# EAGLE schematic DFTT (EAGLE 7.4.0)

## Sheet 1 of 2
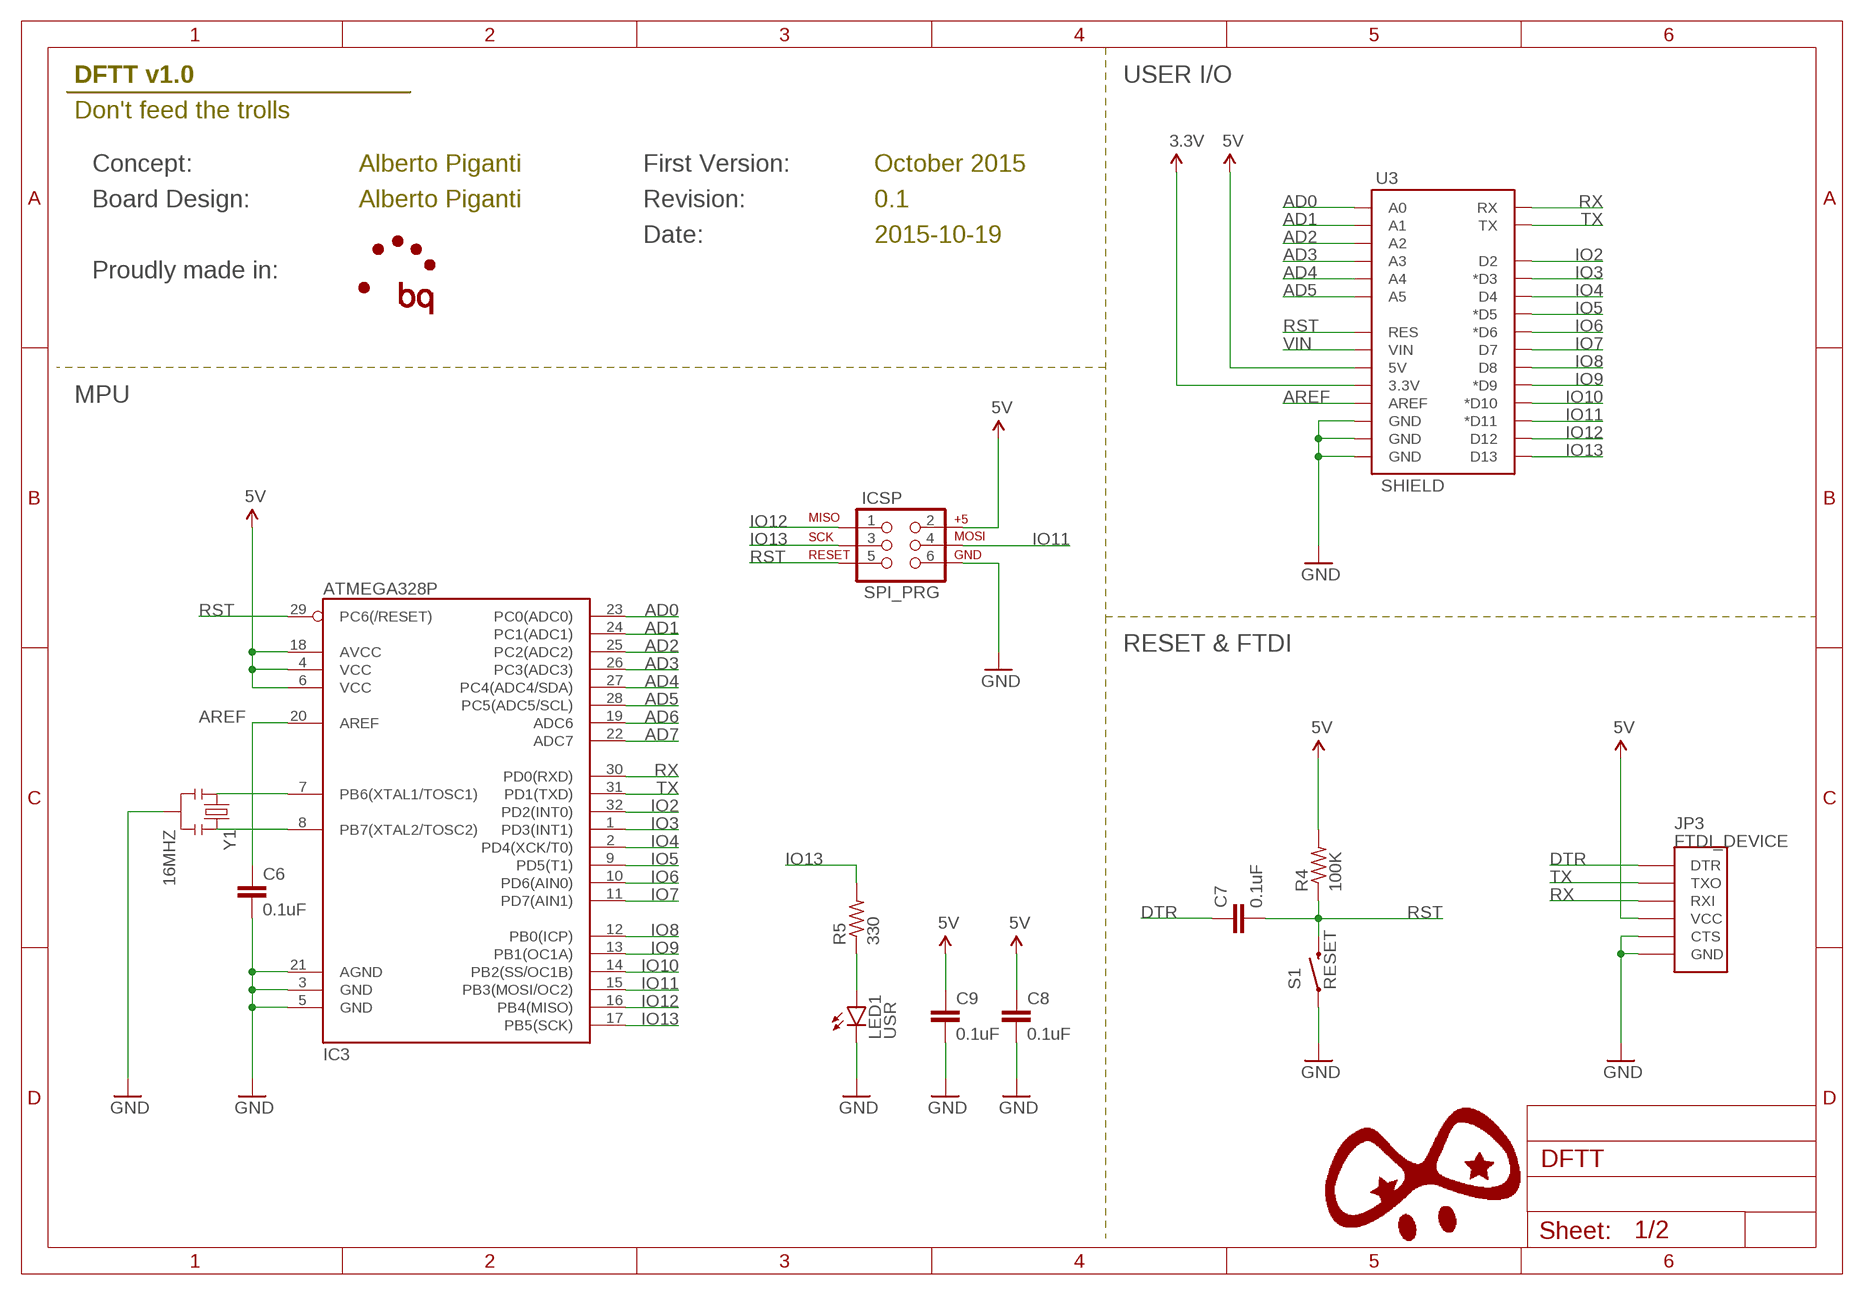
[diagram p0: schematic, sheet 1]

### Parts
C6  0.1uF  C-EUC0603  [C0603]
C7  0.1uF  C-EUC0603  [C0603]
C8  0.1uF  C-EUC0603  [C0603]
C9  0.1uF  C-EUC0603  [C0603]
IC3  ATMEGA328P  ATMEGA328_SMT  [TQFP32-08]
ICSP  SPI_PRG  AVR_SPI_PRG_6NS  [2X3-NS]
JP3  FTDI_DEVICE  [FTDI_DEVICE_SIDE]
LED1  USR  LED0603  [LED-0603]
R4  100K  R-US_R0603  [R0603]
R5  330  R-US_R0603  [R0603]
S1  RESET  SWITCH-MOMENTARY-2SMD-1101NE  [TACTILE-SWITCH-1101NE]
U3  SHIELD  ARDUINO_SHIELDNO_SILK  [DUEMILANOVE_VIAS]
Y1  16MHZ  RESONATOR16MHZ  [RESONATOR-SMD]

### Nets
3.3V: U3.3.3V ; also sheet 2
5V: C8.1 C9.1 IC3.4(VCC) IC3.6(VCC) IC3.18(AVCC) ICSP.2 JP3.P$4(VCC) R4.2 U3.5V ; also sheet 2
AD0: IC3.23(PC0(ADC0)) U3.A0
AD1: IC3.24(PC1(ADC1)) U3.A1
AD2: IC3.25(PC2(ADC2)) U3.A2
AD3: IC3.26(PC3(ADC3)) U3.A3
AD4: IC3.27(PC4(ADC4/SDA)) U3.A4
AD5: IC3.28(PC5(ADC5/SCL)) U3.A5
AD6: IC3.19(ADC6)
AD7: IC3.22(ADC7)
AREF: C6.1 IC3.20(AREF) U3.AREF
DTR: C7.1 JP3.P$1(DTR)
GND: C6.2 C8.2 C9.2 IC3.3(GND) IC3.5(GND) IC3.21(AGND) ICSP.6 JP3.P$5(CTS) JP3.P$6(GND) LED1.C S1.1 U3.GND@0(GND) U3.GND@1(GND) U3.GND@2(GND) Y1.2 ; also sheet 2
IO2: IC3.32(PD2(INT0)) U3.D2
IO3: IC3.1(PD3(INT1)) U3.D3(*D3) ; also sheet 2
IO4: IC3.2(PD4(XCK/T0)) U3.D4
IO5: IC3.9(PD5(T1)) U3.D5(*D5) ; also sheet 2
IO6: IC3.10(PD6(AIN0)) U3.D6(*D6)
IO7: IC3.11(PD7(AIN1)) U3.D7
IO8: IC3.12(PB0(ICP)) U3.D8
IO9: IC3.13(PB1(OC1A)) U3.D9(*D9) ; also sheet 2
IO10: IC3.14(PB2(SS/OC1B)) U3.D10(*D10) ; also sheet 2
IO11: IC3.15(PB3(MOSI/OC2)) ICSP.4 U3.D11(*D11) ; also sheet 2
IO12: IC3.16(PB4(MISO)) ICSP.1 U3.D12
IO13: IC3.17(PB5(SCK)) ICSP.3 R5.2 U3.D13
N$9: LED1.A R5.1
N$31: IC3.7(PB6(XTAL1/TOSC1)) Y1.1
N$32: IC3.8(PB7(XTAL2/TOSC2)) Y1.3
RST: C7.2 IC3.29(PC6(/RESET)) ICSP.5 R4.1 S1.2 U3.RES
RX: IC3.30(PD0(RXD)) JP3.P$3(RXI) U3.RX
TX: IC3.31(PD1(TXD)) JP3.P$2(TXO) U3.TX
VIN: U3.VIN

### Notes on the sheet
- DFTT v1.0 | USER I/O
- Don't feed the trolls
- Concept: | Alberto Piganti | First Version: | October 2015
- Board Design: | Alberto Piganti | Revision: | 0.1
- Date: | 2015-10-19
- Proudly made in:
- MPU
- RESET & FTDI

## Sheet 2 of 2
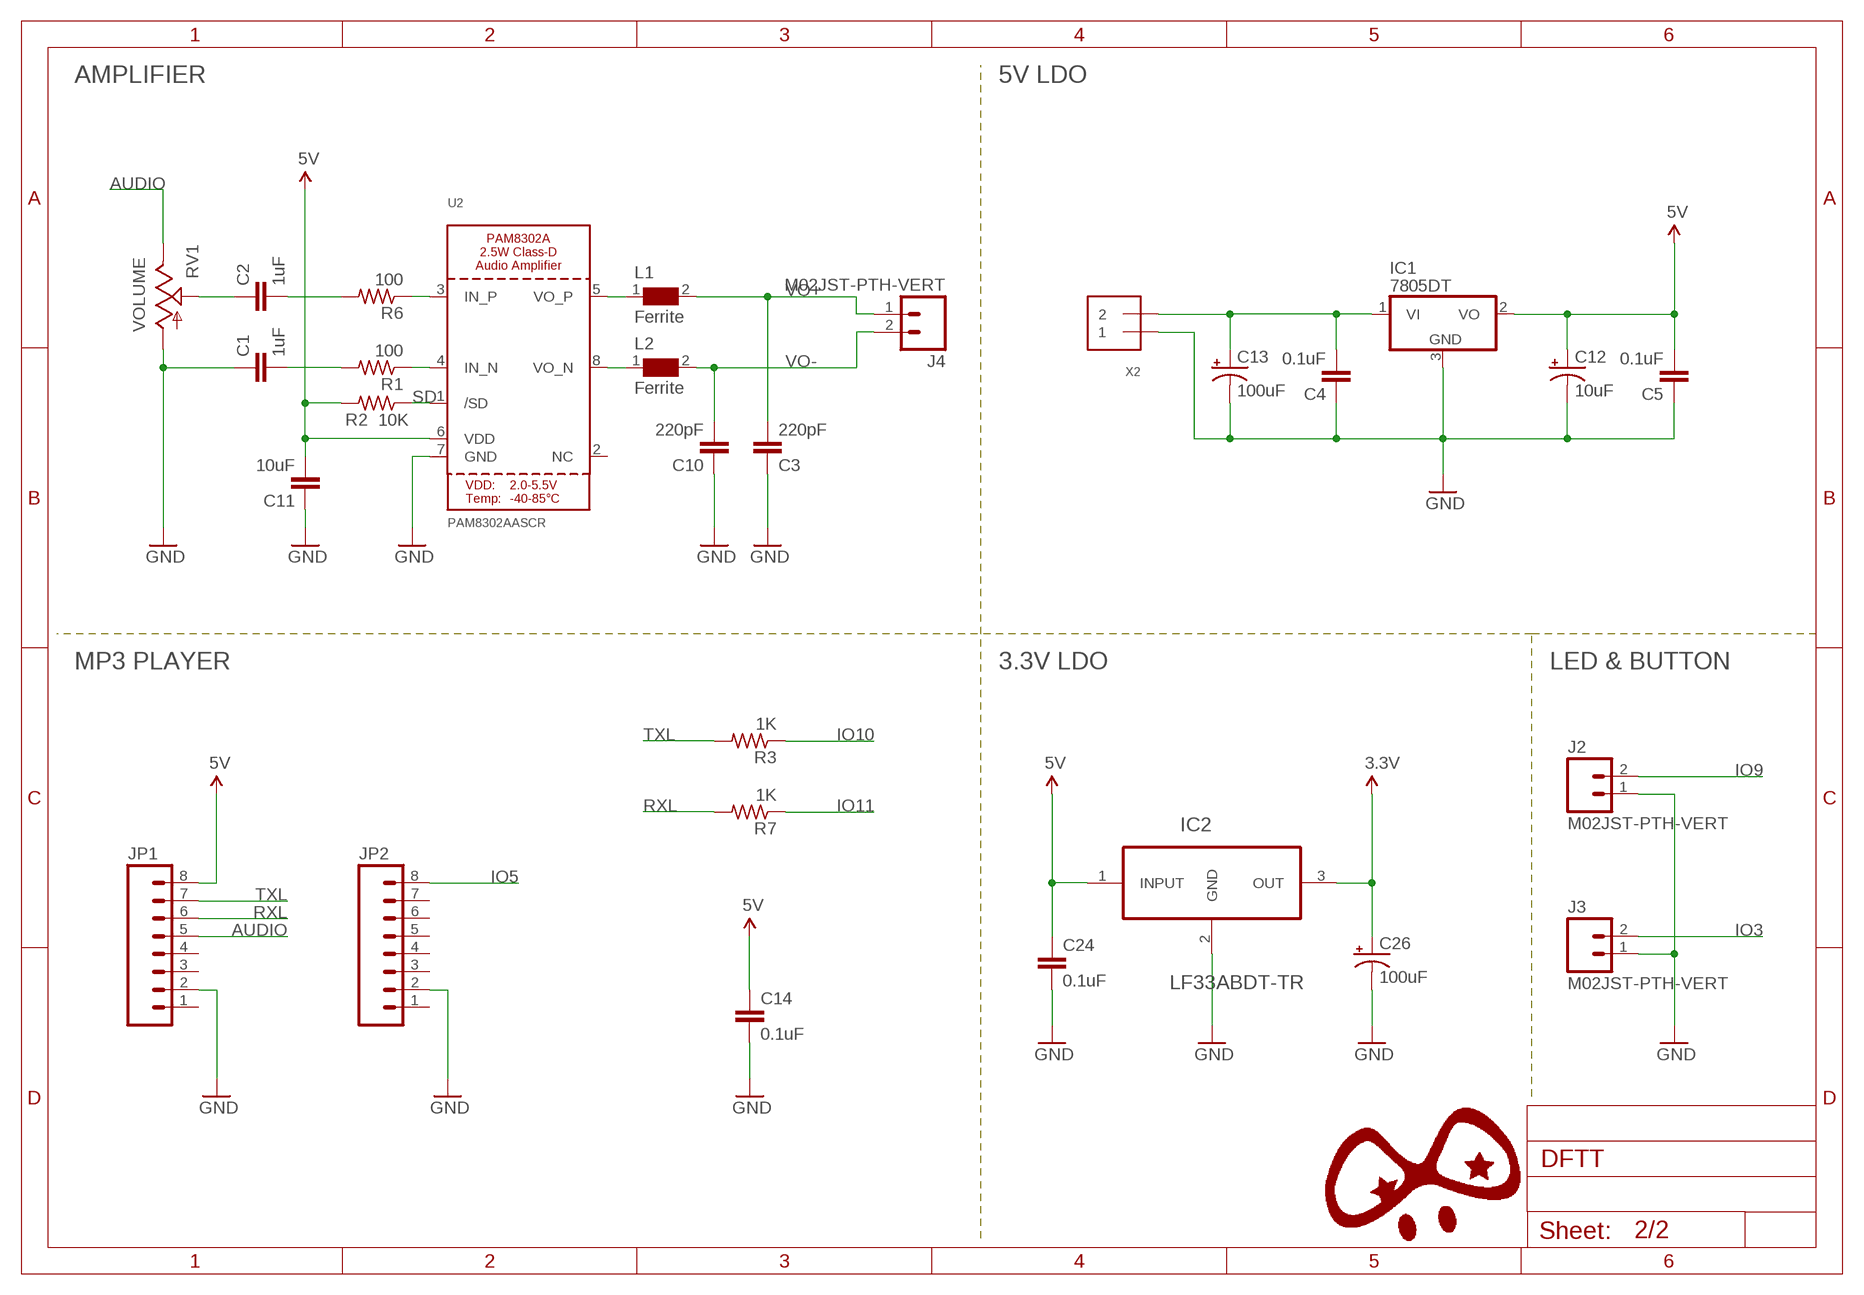
[diagram p1: schematic, sheet 2]

### Parts
C1  1uF  C-EUC0603  [C0603]
C2  1uF  C-EUC0603  [C0603]
C3  220pF  C-EUC0603  [C0603]
C4  0.1uF  C-EUC0603  [C0603]
C5  0.1uF  C-EUC0603  [C0603]
C10  220pF  C-EUC0603  [C0603]
C11  10uF  C-EUC0603  [C0603]
C12  10uF  CAP_POLD  [PANASONIC_D]
C13  100uF  CAP_POLD  [PANASONIC_D]
C14  0.1uF  CAP1210  [1210]
C24  0.1uF  CAP1210  [1210]
C26  100uF  CAP_POLD  [PANASONIC_D]
IC1  7805DT  [TO252]
IC2  LF33ABDT-TR  [TO228P972X240-3N]
J2  M02JST-PTH-VERT  [JST-2-PTH-VERT]
J3  M02JST-PTH-VERT  [JST-2-PTH-VERT]
J4  M02JST-PTH-VERT  [JST-2-PTH-VERT]
JP1  M08LOCK  [1X08_LOCK]
JP2  M08LOCK  [1X08_LOCK]
L1  Ferrite  FERRITE-74279261_0603  [0603]
L2  Ferrite  FERRITE-74279261_0603  [0603]
R1  100  R-US_R0603  [R0603]
R2  10K  R-US_R0603  [R0603]
R3  1K  R-US_R0603  [R0603]
R6  100  R-US_R0603  [R0603]
R7  1K  R-US_R0603  [R0603]
RV1  VOLUME  POTTRIM  [TRIM_POT]
U2  PAM8302AASCR  AUDIOAMP_PAM8302A  [MSOP8_0.65MM]
X2  TERMBLOCK_1X2  [TERMBLOCK_1X2-3.5MM]

### Nets
3.3V: C26.+ IC2.3(OUT) ; also sheet 1
5V: C5.2 C11.2 C12.+ C14.1 C24.1 IC1.2(VO) IC2.1(INPUT) JP1.8 R2.2 U2.6(VDD) ; also sheet 1
AUDIO: JP1.5 RV1.2(E)
GND: C1.1 C3.1 C4.1 C5.1 C10.1 C11.1 C12.- C13.- C14.2 C24.2 C26.- IC1.3(GND) IC2.2(GND) J2.1 J3.1 JP1.2 JP2.2 RV1.3(A) U2.7(GND) X2.1 ; also sheet 1
IO3: J3.2 ; also sheet 1
IO5: JP2.8 ; also sheet 1
IO9: J2.2 ; also sheet 1
IO10: R3.1 ; also sheet 1
IO11: R7.1 ; also sheet 1
N$1: R1.1 U2.4(IN_N)
N$2: R6.1 U2.3(IN_P)
N$3: C2.2 R6.2
N$4: C1.2 R1.2
N$5: L2.1 U2.8(VO_N)
N$6: L1.1 U2.5(VO_P)
N$7: C2.1 RV1.1(S)
N$8: C4.2 C13.+ IC1.1(VI) X2.2
RXL: JP1.6 R7.2
SD: R2.1 U2.1(/SD)
TXL: JP1.7 R3.2
VO+: C3.2 J4.1 L1.2
VO-: C10.2 J4.2 L2.2
Unconnected: JP1.1 JP1.3 JP1.4 JP2.1 JP2.3 JP2.4 JP2.5 JP2.6 JP2.7 U2.2(NC)

### Notes on the sheet
- AMPLIFIER | 5V LDO
- MP3 PLAYER | 3.3V LDO | LED & BUTTON

## Library data of the parts
C1-C11 = resistor:C-EU: CAPACITOR, European symbol
C12 C13 C26 = SparkFun-Capacitors:CAP_POL: Capacitor Polarized These are standard SMD and PTH capacitors. Normally 10uF, 47uF, and 100uF in electrolytic and tantalum varieties. Always verify the external diameter of the through hole cap, it varies with capacity, voltage, and manufacturer. The EIA devices should be standard.
C14 C24 = SparkFun-Capacitors:CAP: Capacitor Standard 0603 ceramic capacitor, and 0.1" leaded capacitor.
IC1 = linear:78*: Positive VOLTAGE REGULATOR Source: http://cache.national.com/ds/LM/LM78L05.pdf http://www.fairchildsemi.com/ds/LM/LM7805.pdf
IC2 = STM-LF33ABDT-TR:LF33ABDT-TR: LDO, 0.45VDO, 1A, 3.3V, 1%, 3TO252; MPN: LF33ABDT-TR; OC_FARNELL: 2253503; OC_NEWARK: 26M0226; PACKAGE: DPAK; SUPPLIER: STMicroelectronics
IC3 = SparkFun-DigitalIC:ATMEGA328_SMT: 32-Pin Atmega328 part Commonly used on Arduino compatible boards Available in QFP and QFN packages TQFP is IC-09069 QFN is non-stock; PROD_ID: IC-09069
ICSP = SparkFun-Connectors:AVR_SPI_PRG_6: AVR ISP 6 Pin This is the reduced ISP connector for AVR programming. Common on Arduino. This footprint will take up less PCB space and can be used with a 10-pin to 6-pin adapter such as SKU: BOB-08508 **Special note about "TEST_POINT" package. The stop mask is on the top side, so if you want your programming test points to be on the bottom of your board, make sure to place this package on the bottom side of the board. This also ensure that the orientation to program from the bottom side will be correct.
J2-J4 = SparkFun-Connectors:M02: Standard 2-pin 0.1" header. Use with - straight break away headers ( PRT-00116) - right angle break away headers (PRT-00553) - swiss pins (PRT-00743) - machine pins (PRT-00117) - female headers (PRT-00115) Molex polarized connector foot print use with: PRT-08233 with associated crimp pins and housings. 2.54_SCREWTERM for use with PRT-10571. 3.5mm Screw Terminal footprints for PRT-08084 5mm Screw Terminal footprints for use with PRT-08432
JP1 JP2 = SparkFun-Connectors:M08: Header 8 Standard 8-pin 0.1" header. Use with straight break away headers (SKU : PRT-00116), right angle break away headers (PRT-00553), swiss pins (PRT-00743), machine pins (PRT-00117), and female headers (PRT-00115).
JP3 = SparkFun-Connectors:FTDI_DEVICE: Connector which mates to FTDI basic or FTDI cable.
L1 L2 = Honey_v2:FERRITE: SMD EMI Suppression Ferrite Beads; MPN: 74279261; OC_FARNELL: 1635684; OC_NEWARK: 08P2431; PACKAGE: IND-0603; SUPPLIER: Wuerth Elektronik
LED1 = SparkFun-LED:LED: LEDs Standard schematic elements and footprints for 5mm, 3mm, 1206, and 0603 sized LEDs. 5mm - Spark Fun Electronics SKU : COM-00529 (and others)
R1-R7 = resistor:R-US_: RESISTOR, American symbol
RV1 = SparkFun-Electromechanical:POT
S1 = SparkFun-Electromechanical:SWITCH-MOMENTARY-2: Various NO switches- pushbuttons, reed, etc; PROD_ID: SWCH-00815
U2 = microbuilder:AUDIOAMP_PAM8302A: PAM8302A - 2.5W Class-D Mono Audio Amplifier MSOP8 = PAM8302AASCR
U3 = SparkFun-Boards:ARDUINO_SHIELD: Arduino shield footprint
X2 = microbuilder:TERMBLOCK_1X2: 3.5mm Terminal block http://www.ladyada.net/library/pcb/eaglelibrary.html
Y1 = SparkFun-FreqCtrl:RESONATOR: Resonator Small SMD resonator. Used, eg, on the Arduino Pro/ Pro Mini boards. 8MHz- XTAL-08895 16MHz- XTAL-08900; PROD_ID: XTAL-08900